# Altium schematic sheet LFO.SchDoc
size A4; SheetNumber: 4; SheetTotal: 7
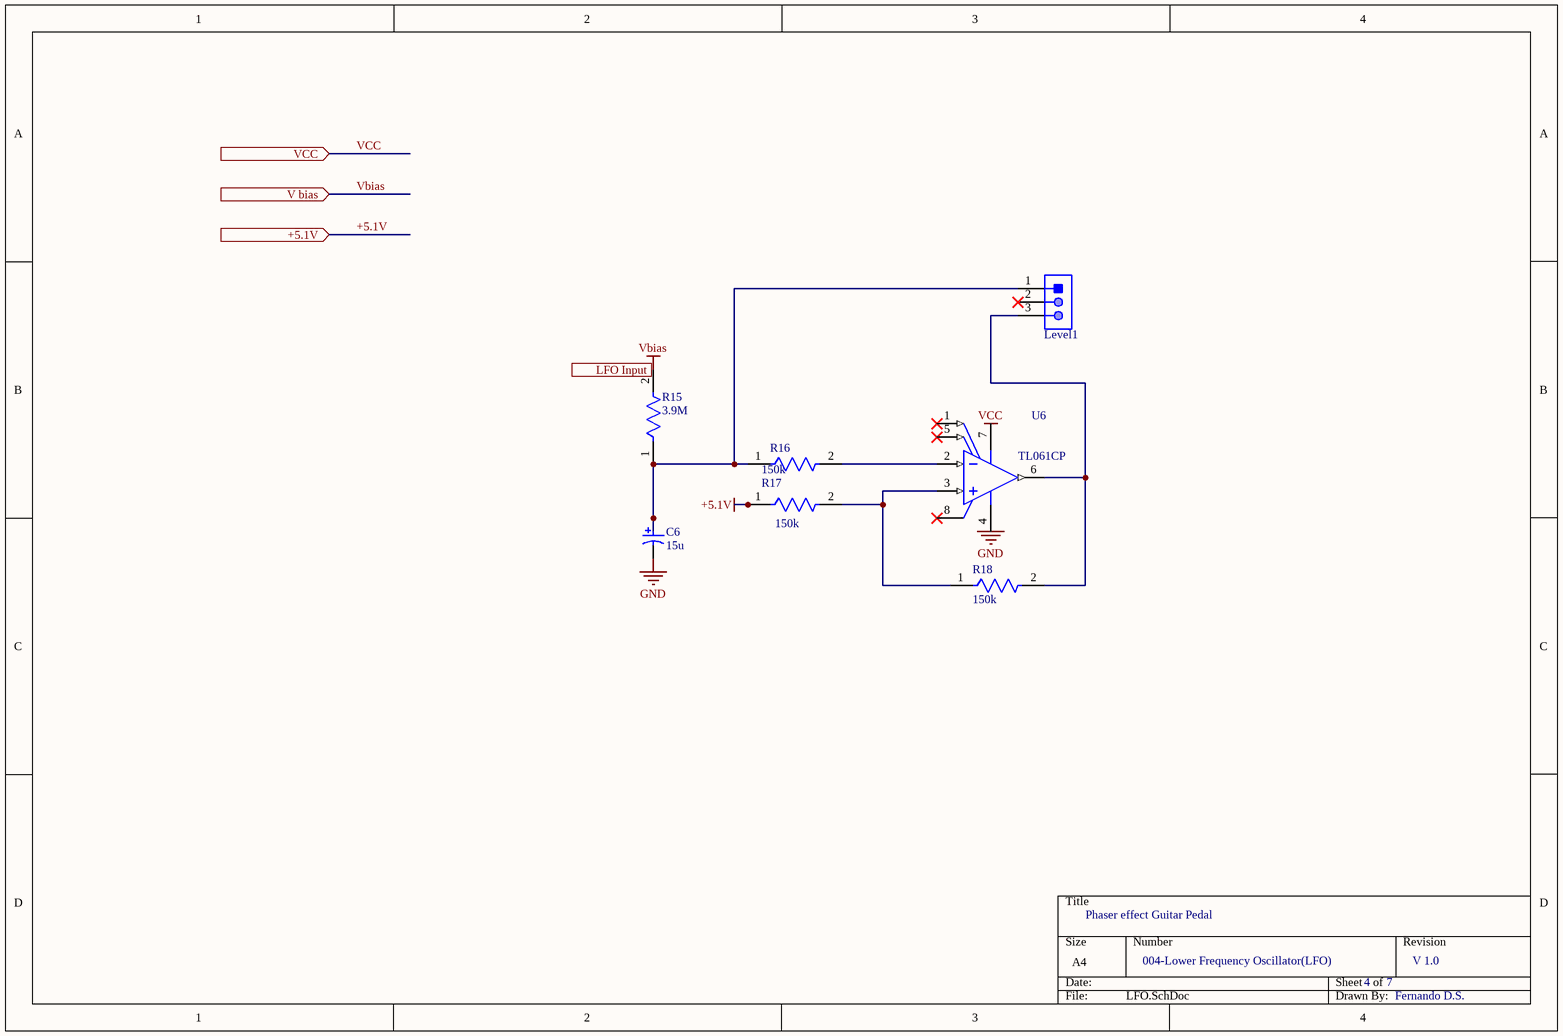
[diagram p0: LFO.SchDoc]

## Parts
C6  15u  [NIC-PLF-10x13-2_V]
Level1  100K  [TECO-171825-3_V]  (value not drawn)
R15  3.9M  [FP-MRS25-MFG]
R16  150k  [FP-MRS25-MFG]
R17  150k  [FP-MRS25-MFG]
R18  150k  [FP-MRS25-MFG]
U6  TL061CP  [P0008A]

## Ports
+5.1V (in, see Main[3C], Input Buffer[1A], Output Mixer[1A], Phase Shifting Stage[1A], Power supply[4A]), LFO Input (in, see Main[3C]), V bias (in, see Main[3C], Power supply[4A]), VCC (in, see Main[3C], Input Buffer[1A], Phase Shifting Stage[1A], Power supply[4B], Selection[1A])

## Nets
+5.1V: R17.1 ; port +5.1V
GND: C6.2
Vbias: R15.2 ; port V bias
VCC: port VCC
NetC6_1: C6.1 Level1.1 R15.1 R16.1
NetLevel1_3: Level1.3 R18.2 U6.6(OUT)
NetR16_2: R16.2 U6.2(IN-)
NetR17_2: R17.2 R18.1 U6.3(IN+)

Not connected (* = marked no-connect by the designer): Level1 2*; U6 1(OFFSET_N1)* 4(VCC-) 5(OFFSET_N2)* 7(VCC+) 8(NC)*

## Notes on the sheet
- Phaser effect Guitar Pedal
- 004-Lower Frequency Oscillator(LFO)
- 4
- 7
- V 1.0
- Fernando D.S.
- Labels drawn without touching a wire or pin: GND, VCC

## Library data of the parts
C6 = CMP-1234-00001-1: Aluminum Electrolytic Capacitor, 470 uF +/-20%, 10 V, -55 to 105 degC, 2-Pin THD, RoHS; Manufacturer: Nichicon; PartNumber: PLF1A471MDO1; Leakage Current: 0.94 mA; Rated Ripple: 5700 mA; Rated Voltage: 10 V; Rated Capacitance: 470 uF; ComponentLink3URL: http://nichicon-us.com/english/products/pdfs/e-lf.pdf; PackageDescription: 2-Pin Through Hole Device, Dia 10 mm, Body Length 13 mm, Pin Spacing 5 mm; ComponentLink2URL: http://nichicon-us.com/english/products/pdfs/e-lf.pdf; RoHS: TRUE; ComponentLink1URL: http://www.nichicon.co.jp/; ComponentLink2Description: Datasheet; Capacitance Tolerance: +/-20%; ComponentLink1Description: Manufacturer URL; Mounting Technology: Through Hole; ComponentLink3Description: Package Specification; Temperature Range: -55 to 105 degC; DatasheetVersion: Sep-13
Level1 = CMP-2000-07494-1: Male Header, Pitch 2.5 mm, 1 x 3 Position, Height 10.4 mm, Tail Length 3.6 mm, / -20 to 95 degC / , RoHS, Bulk; Manufacturer: TE Connectivity; Mating Alignment: Yes(With); Tail Length: 0.142inch; Mating Post Length: 7.5mm; PCB Thickness: 0.063inch; PCB Mount Alignment: No(Without); Voltage Rating: 350V; Max Voltage Rating (AC): 250V; Plating Thickness: 0.8um; PCB Mounting Orientation: Vertical; Number of Positions: 3; PCB Mount Retention: Without; Max Current Rating: 3.5A; Max Voltage Rating (DC): 350.25kV; Pitch: 2.5mm; Approvals: UL; Contact Resistance: 20mOhm; Mount: ThroughHole; Length: 7.5mm; Orientation: Straight; Contact Mating Length: 0.295inch; Contact Material: Brass; Housing Material: Nylon; Package Description: Male Header, Pitch 2.5 mm, 1 x 3 Position, Height 10.4 mm, Tail Length 3.6 mm; Colour: Natural; Backwall/Post Interruptions: No(Without); Min Operating Temperature: -20degC; Mating Retention: Yes(With); Connector Type: Header; Packaging: Bag; RoHSCompliant: True; Package Reference: 171825-3; Contact Shape: Square; Strain Relief: No(Without); Contact Gender: Male; Number of Contacts: 3; Manufacturer URL: http://www.te.com/; Height: 0.409inch; Contact Retention: No(Without); Datasheet Version: Rev. Y3, 12/2016; Panel Mount Retention: No(Without); Datasheet URL: http://www.te.com/commerce/DocumentDelivery/DDEController?Action=showdoc&DocId=Customer+Drawing%7F171825%7FY3%7Fpdf%7FEnglish%7FENG_CD_171825_Y3.pdf%7F171825-3; Termination: Solder; Mounting Technology: ThroughHole; Max Operating Temperature: 95degC; Flammability Rating: UL94V-0; REACH SVHC: NoSVHC; Housing Colour: Natural; Package Quantity: 1000; Number of Rows: 1; Depth: 4.9mm; Contact Plating: Tin
R15-R18 = CMP-00030-42757237-1: MRS25000C1000FRP00 Resistor, 100 Ohm, ± 1%, 600 mW, Axial Leaded, Metal Film (Thin Film), Professional; Max Power Dissipation: 600mW; Resistance: 100Ω; Voltage Rating: 350V; Temperature Coefficient: 50ppm/°C; Lead Diameter: 600µm; RoHS: Compliant; Radiation Hardening: No; Schedule B: 8533210090, 8533210090; Length: 6.5mm; Packaging: Tape & Reel (TR); Number of Terminations: 2; Mount: Through Hole; Width: 2.5mm; Tolerance: 1%; Military Standard: Not; Voltage Rating (DC): 350V; Contact Plating: Tin; Number of Pins: 2; Max Operating Temperature: 155°C; NexarPartId: 42757237; Diameter: 2.5mm; Composition: Metal Film, Thin Film; REACH SVHC: Unknown; Power Rating: 600mW; Lead Free: Lead Free; Termination: Axial; Case/Package: Axial; Min Operating Temperature: -55°C
U6 = CMP-0017-01052-2: Low-Power JFET-Input General-Purpose Operational Amplifier, 7 to 36 V, 0 to 70 degC, 8-pin DIP (P8), Pb-Free (RoHS); Manufacturer: Texas Instruments; CMRR(Min)(dB): 70; Offset Drift(Typ)(uV/C): 10; Vio (25C)(Max)(mV): 15; Rating: Military; Total Supply Voltage(Min)(+5V is 5, +/-5V is 10): 7; Vn at 1kHz(Typ)(nV/rtHz): 42; GBW(Typ)(MHz): 1; Total Supply Voltage(Max)(+5V is 5, +/-5V is 10): 36; Sub Family: General Purpose Amplifier, High Supply Voltage Amplifier (>=30V), Low Power Amp (<=500uA); Slew Rate(Typ)(V/us): 3.5; Iq per channel(Max)(mA): 0.25; IIB(Max)(pA): 400; ComponentLink2URL: http://www.ti.com/lit/ds/symlink/tl061.pdf; Mounting Technology: Through Hole; Code_JEDEC: MS-001; PackageVersion: 4040082/E, 04/2010; ComponentLink1URL: http://www.ti.com/; PartNumber: TL061CP; PackageReference: P0008A; ComponentLink1Description: Manufacturer URL; Eco-Plan: Pb-Free (RoHS); ComponentLink3URL: http://www.ti.com/litv/pdf/mpdi001b; Number of Channels: 1; DatasheetVersion: SLOS078J; ComponentLink3Description: Package Specification; PackageDescription: 8-Pin Plastic In-Line, Body 9.59 x 6.35 mm, Pitch 2.54 mm; ComponentLink2Description: Datasheet